# EAGLE design Garage_Controller (EAGLE 7.7.0)
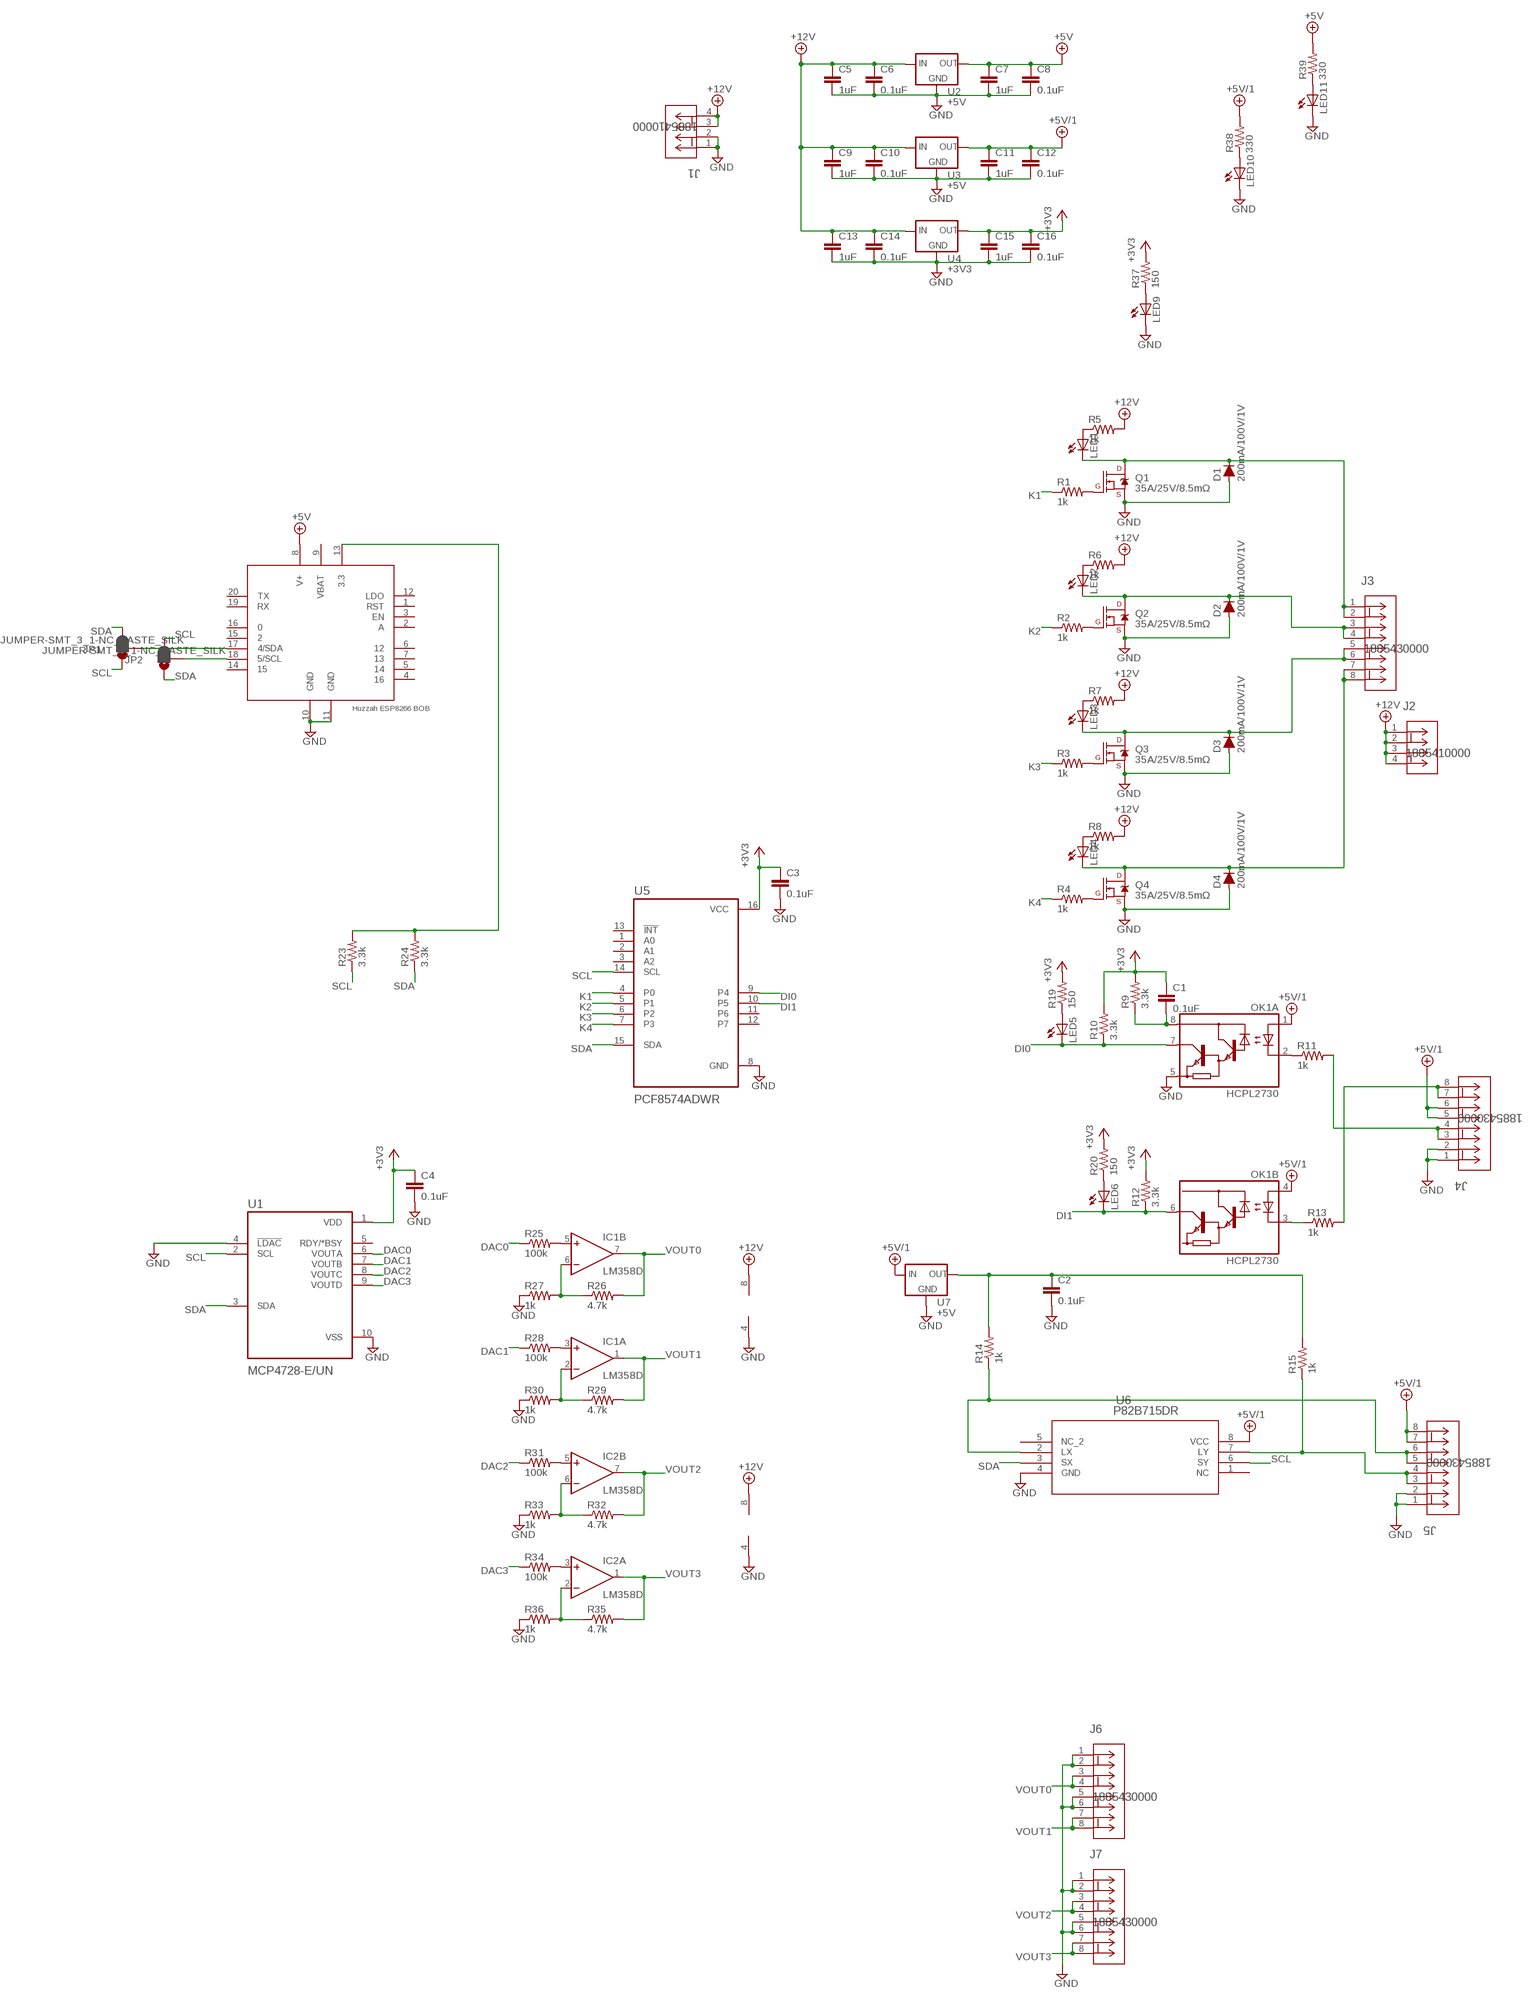
[diagram p0: schematic, sheet 1]

## Parts
C1  0.1uF  C-EUC0805  [C0805]
C2  0.1uF  C-EUC0805  [C0805]
C3  0.1uF  C-EUC0805  [C0805]
C4  0.1uF  C-EUC0805  [C0805]
C5  1uF  C-EUC0805  [C0805]
C6  0.1uF  C-EUC0805  [C0805]
C7  1uF  C-EUC0805  [C0805]
C8  0.1uF  C-EUC0805  [C0805]
C9  1uF  C-EUC0805  [C0805]
C10  0.1uF  C-EUC0805  [C0805]
C11  1uF  C-EUC0805  [C0805]
C12  0.1uF  C-EUC0805  [C0805]
C13  1uF  C-EUC0805  [C0805]
C14  0.1uF  C-EUC0805  [C0805]
C15  1uF  C-EUC0805  [C0805]
C16  0.1uF  C-EUC0805  [C0805]
D1  200mA/100V/1V  DIODE-1N4148  [DIODE-1N4148]
D2  200mA/100V/1V  DIODE-1N4148  [DIODE-1N4148]
D3  200mA/100V/1V  DIODE-1N4148  [DIODE-1N4148]
D4  200mA/100V/1V  DIODE-1N4148  [DIODE-1N4148]
IC1  LM358D  [SO08]
IC2  LM358D  [SO08]
J1  1885410000  [CONN_1885410000_WED]
J2  1885410000  [CONN_1885410000_WED]
J3  1885430000  [CONN_1885430000_WED]
J4  1885430000  [CONN_1885430000_WED]
J5  1885430000  [CONN_1885430000_WED]
J6  1885430000  [CONN_1885430000_WED]
J7  1885430000  [CONN_1885430000_WED]
JP1  JUMPER-SMT_3_1-NC_PASTE_SILK  [SMT-JUMPER_3_1-NC_PASTE_SILK]
JP2  JUMPER-SMT_3_1-NC_PASTE_SILK  [SMT-JUMPER_3_1-NC_PASTE_SILK]
LED1  LEDCHIP-LED0805  [CHIP-LED0805]
LED2  LEDCHIP-LED0805  [CHIP-LED0805]
LED3  LEDCHIP-LED0805  [CHIP-LED0805]
LED4  LEDCHIP-LED0805  [CHIP-LED0805]
LED5  LEDCHIP-LED0805  [CHIP-LED0805]
LED6  LEDCHIP-LED0805  [CHIP-LED0805]
LED9  LEDCHIP-LED0805  [CHIP-LED0805]
LED10  LEDCHIP-LED0805  [CHIP-LED0805]
LED11  LEDCHIP-LED0805  [CHIP-LED0805]
OK1  HCPL2730  [DIL08]
Q1  35A/25V/8.5mΩ  MOSFET-NCH-FDD8780  [TO-252/DPAK]
Q2  35A/25V/8.5mΩ  MOSFET-NCH-FDD8780  [TO-252/DPAK]
Q3  35A/25V/8.5mΩ  MOSFET-NCH-FDD8780  [TO-252/DPAK]
Q4  35A/25V/8.5mΩ  MOSFET-NCH-FDD8780  [TO-252/DPAK]
R1  1k  R-US_R0805  [R0805]
R2  1k  R-US_R0805  [R0805]
R3  1k  R-US_R0805  [R0805]
R4  1k  R-US_R0805  [R0805]
R5  1k  R-US_R0805  [R0805]
R6  1k  R-US_R0805  [R0805]
R7  1k  R-US_R0805  [R0805]
R8  1k  R-US_R0805  [R0805]
R9  3.3k  R-US_R0805  [R0805]
R10  3.3k  R-US_R0805  [R0805]
R11  1k  R-US_R0805  [R0805]
R12  3.3k  R-US_R0805  [R0805]
R13  1k  R-US_R0805  [R0805]
R14  1k  R-US_R0805  [R0805]
R15  1k  R-US_R0805  [R0805]
R19  150  R-US_R0805  [R0805]
R20  150  R-US_R0805  [R0805]
R23  3.3k  R-US_R0805  [R0805]
R24  3.3k  R-US_R0805  [R0805]
R25  100k  R-US_R0805  [R0805]
R26  4.7k  R-US_R0805  [R0805]
R27  1k  R-US_R0805  [R0805]
R28  100k  R-US_R0805  [R0805]
R29  4.7k  R-US_R0805  [R0805]
R30  1k  R-US_R0805  [R0805]
R31  100k  R-US_R0805  [R0805]
R32  4.7k  R-US_R0805  [R0805]
R33  1k  R-US_R0805  [R0805]
R34  100k  R-US_R0805  [R0805]
R35  4.7k  R-US_R0805  [R0805]
R36  1k  R-US_R0805  [R0805]
R37  150  R-US_R0805  [R0805]
R38  330  R-US_R0805  [R0805]
R39  330  R-US_R0805  [R0805]
U1  MCP4728-E/UN  [SOP50P490X110-10N]
U2  +5V  V_REG_78XX7812  [TO-252]
U3  +5V  V_REG_78XX7812  [TO-252]
U4  +3V3  V_REG_78XX7812  [TO-252]
U5  PCF8574ADWR  [SOIC127P1030X265-16N]
U6  P82B715DR  [SO-08]
U7  +5V  V_REG_78XX7812  [TO-252]
U$2  HUZZAH_ESP8266_BREAKOUT  [HUZZAH_ESP8266_BREAKOUT]

## Nets
+3V3: C1.1 C3.1 C4.1 C15.1 C16.1 R9.2 R10.2 R12.2 R19.2 R20.2 R37.2 U1.1(VDD) U4.2(OUT) U5.16(VCC)
+5V: C7.1 C8.1 R39.2 U2.2(OUT) U$2.8(V+)
+5V/1: C11.1 C12.1 J4.5 J4.6 J5.7 J5.8 OK1.1(A:A1) OK1.4(B:A2) R38.2 U3.2(OUT) U6.8(VCC) U7.1(IN)
+12V: C5.1 C6.1 C9.1 C10.1 C13.1 C14.1 IC1.8(P:V+) IC2.8(P:V+) J1.3 J1.4 J2.1 J2.2 J2.3 J2.4 R5.2 R6.2 R7.2 R8.2 U2.1(IN) U3.1(IN) U4.1(IN)
DAC0: R25.1 U1.6(VOUTA)
DAC1: R28.1 U1.7(VOUTB)
DAC2: R31.1 U1.8(VOUTC)
DAC3: R34.1 U1.9(VOUTD)
DI0: LED5.C OK1.7(A:VO1) R10.1 U5.9(P4)
DI1: LED6.C OK1.6(B:VO2) R12.1 U5.10(P5)
GND: C2.2 C3.2 C4.2 C5.2 C6.2 C7.2 C8.2 C9.2 C10.2 C11.2 C12.2 C13.2 C14.2 C15.2 C16.2 D1.A D2.A D3.A D4.A IC1.4(P:V-) IC2.4(P:V-) J1.1 J1.2 J4.1 J4.2 J5.1 J5.2 J6.1 J6.2 J6.5 J6.6 J7.1 J7.2 J7.5 J7.6 LED9.C LED10.C LED11.C OK1.5(A:GND) Q1.3(S) Q2.3(S) Q3.3(S) Q4.3(S) R27.1 R30.1 R33.1 R36.1 U1.4(!LDAC) U1.10(VSS) U2.3(GND) U3.3(GND) U4.3(GND) U5.8(GND) U6.4(GND) U7.3(GND) U$2.10(GND) U$2.11(GND)
K1: R1.1 U5.4(P0)
K2: R2.1 U5.5(P1)
K3: R3.1 U5.6(P2)
K4: R4.1 U5.7(P3)
N$1: D1.C J3.1 J3.2 LED1.C Q1.2(D)
N$2: Q1.1(G) R1.2
N$3: D2.C J3.3 J3.4 LED2.C Q2.2(D)
N$4: Q2.1(G) R2.2
N$5: D3.C J3.5 J3.6 LED3.C Q3.2(D)
N$6: Q3.1(G) R3.2
N$7: D4.C J3.7 J3.8 LED4.C Q4.2(D)
N$8: Q4.1(G) R4.2
N$9: LED1.A R5.1
N$10: IC1.5(B:+IN) R25.2
N$11: LED2.A R6.1
N$12: LED3.A R7.1
N$13: J4.7 J4.8 R13.2
N$14: LED4.A R8.1
N$15: C1.2 OK1.8(A:VCC) R9.1
N$16: IC1.6(B:-IN) R26.1 R27.2
N$17: OK1.2(A:C1) R11.1
N$18: IC1.3(A:+IN) R28.2
N$19: J4.3 J4.4 R11.2
N$20: J5.5 J5.6 R14.1 U6.2(LX)
N$21: C2.1 R14.2 R15.2 U7.2(OUT)
N$24: IC1.2(A:-IN) R29.1 R30.2
N$25: J5.3 J5.4 R15.1 U6.7(LY)
N$26: OK1.3(B:C2) R13.1
N$27: LED5.A R19.1
N$29: LED6.A R20.1
N$31: IC2.5(B:+IN) R31.2
N$32: IC2.6(B:-IN) R32.1 R33.2
N$33: IC2.2(A:-IN) R35.1 R36.2
N$34: IC2.3(A:+IN) R34.2
N$35: R23.2 R24.2 U$2.13(3.3)
N$36: LED9.A R37.1
N$37: LED10.A R38.1
N$38: LED11.A R39.1
N$39: JP2.2 U$2.18(5/SCL)
N$40: JP1.2 U$2.17(4/SDA)
SCL: JP1.1 JP2.3 R23.1 U1.2(SCL) U5.14(SCL) U6.6(SY)
SDA: JP1.3 JP2.1 R24.1 U1.3(SDA) U5.15(SDA) U6.3(SX)
VOUT0: IC1.7(B:OUT) J6.3 J6.4 R26.2
VOUT1: IC1.1(A:OUT) J6.7 J6.8 R29.2
VOUT2: IC2.7(B:OUT) J7.3 J7.4 R32.2
VOUT3: IC2.1(A:OUT) J7.7 J7.8 R35.2
Unconnected: U1.5(RDY/*BSY) U5.1(A0) U5.2(A1) U5.3(A2) U5.11(P6) U5.12(P7) U5.13(!INT) U6.1(NC) U6.5(NC_2) U$2.1(RST) U$2.2(A) U$2.3(EN) U$2.4 U$2.5 U$2.6 U$2.7 U$2.12(LDO) U$2.14 U$2.15 U$2.16 U$2.19(RX) U$2.20(TX)

## Power pins joined to a net without a drawn wire
VBAT: U$2.9(VBAT)

## Library data of the parts
C1-C16 = resistor:C-EU: CAPACITOR, European symbol
D1-D4 = SparkFun-DiscreteSemi:DIODE: Diode These are standard reverse protection diodes and small signal diodes. SparkFun Products: SparkFun SparkPunk Sound Kit <https://www.sparkfun.com/products/11177> SparkFun ESP8266 Thing <https://www.sparkfun.com/products/13231>; PROD_ID: DIO-08378
IC1 IC2 = linear:LM358: OP AMP also LM158; LM258; LM2904 Source: http://cache.national.com/ds/LM/LM158.pdf
J1 J2 = con-weidmueller-sl35:1885410000; COPYRIGHT: Copyright (C) 2026 Ultra Librarian. All rights reserved.; DESCRIPTION: Printed circuit board terminals, 3,81 mm, No. of poles: 2, 135°, Solder pin length: 1,5 mm, black, PUSH IN, Clamping range, max. [rated connection]: 1,5 mm°, Tube; MANUFACTURER_NAME: Weidmuller; MANUFACTURER_PART_NUMBER: 1885410000
J3-J7 = con-weidmueller-sl35:1885430000; COPYRIGHT: Copyright (C) 2026 Ultra Librarian. All rights reserved.; DESCRIPTION: Printed circuit board terminals, 3,81 mm, No. of poles: 4, 135°, Solder pin length: 1,5 mm, black, PUSH IN, Clamping range, max. [rated connection]: 1,5 mm°, Tube; MANUFACTURER_NAME: Weidmuller; MANUFACTURER_PART_NUMBER: 1885430000
JP1 JP2 = SparkFun-Jumpers:JUMPER-SMT_3_1-NC_PASTE: Normally closed solder jumper (1 of 2 connections) This jumper has an aperture in the stencil to allow solder paste to bridge one of the two connections. One connection is normally closed (NC), while the other is normally open (NO). Wick off the solder to open the connection. Reapply solder to reclose the connection. Apply solder to the other side instead to change the current path.
LED1-LED6 LED9-LED11 = led:LED: LED OSRAM: - CHIPLED LG R971, LG N971, LY N971, LG Q971, LY Q971, LO R971, LY R971 LH N974, LH R974 LS Q976, LO Q976, LY Q976 LO Q996 - Hyper CHIPLED LW Q18S LB Q993, LB Q99A, LB R99A - SideLED LS A670, LO A670, LY A670, LG A670, LP A670 LB A673, LV A673, LT A673, LW A673 LH A674 LY A675 LS A676, LA A676, LO A676, LY A676, LW A676 LS A679, LY A679, LG A679 - Hyper Micro SIDELED® LS Y876, LA Y876, LO Y876, LY Y876 LT Y87S - SmartLED LW L88C, LW L88S LB L89C, LB L89S, LG L890 LS L89K, LO L89K, LY L89K LS L896, LA L896, LO L896, LY L896 - TOPLED LS T670, LO T670, LY T670, LG T670, LP T670 LSG T670, LSP T670, LSY T670, LOP T670, LYG T670 LG T671, LOG T671, LSG T671 LB T673, LV T673, LT T673, LW T673 LH T674 LS T676, LA T676, LO T676, LY T676, LB T676, LH T676, LSB T676, LW T676 LB T67C, LV T67C, LT T67C, LS T67K, LO T67K, LY T67K, LW E67C LS E67B, LA E67B, LO E67B, LY E67B, LB E67C, LV E67C, LT E67C LW T67C LS T679, LY T679, LG T679 LS T770, LO T770, LY T770, LG T770, LP T770 LB T773, LV T773, LT T773, LW T773 LH T774 LS E675, LA E675, LY E675, LS T675 LS T776, LA T776, LO T776, LY T776, LB T776 LHGB T686 LT T68C, LB T68C - Hyper Mini TOPLED® LB M676 - Mini TOPLED Santana® LG M470 LS M47K, LO M47K, LY M47K Source: http://www.osram.convergy.de LUXEON: - LUMILED® LXK2-PW12-R00, LXK2-PW12-S00, LXK2-PW14-U00, LXK2-PW14-V00 LXK2-PM12-R00, LXK2-PM12-S00, LXK2-PM14-U00 LXK2-PE12-Q00, LXK2-PE12-R00, LXK2-PE12-S00, LXK2-PE14-T00, LXK2-PE14-U00 LXK2-PB12-K00, LXK2-PB12-L00, LXK2-PB12-M00, LXK2-PB14-N00, LXK2-PB14-P00, LXK2-PB14-Q00 LXK2-PR12-L00, LXK2-PR12-M00, LXK2-PR14-Q00, LXK2-PR14-R00 LXK2-PD12-Q00, LXK2-PD12-R00, LXK2-PD12-S00 LXK2-PH12-R00, LXK2-PH12-S00 LXK2-PL12-P00, LXK2-PL12-Q00, LXK2-PL12-R00 Source: www.luxeon.com KINGBRIGHT: KA-3528ASYC Source: www.kingbright.com
OK1 = optocoupler:HCPL2730: HEWLETT PACKARD OPTO COUPLER; MF: AGILENT TECHNOLOGIES; MPN: HCPL-2730-000E; OC_FARNELL: 9994840; OC_NEWARK: 88H7816
Q1-Q4 = SparkFun-DiscreteSemi:MOSFET-NCH: N-channel MOSFETs Voltage controlled devices that allow control of high current outputs. SparkFun Products: SparkFun OpenScale <https://www.sparkfun.com/products/13261> SparkFun Digital Sandbox <https://www.sparkfun.com/products/12651> SparkFun Monster Moto Shield <https://www.sparkfun.com/products/10182> SparkFun MOSFET Power Controller <https://www.sparkfun.com/products/11214>; PROD_ID: TRANS-09984
R1-R15 R19 R20 R23-R39 = resistor:R-US_: RESISTOR, American symbol
U1 = MCP4728-E_UN:MCP4728-E/UN
U2-U4 U7 = SparkFun-IC-Power:V_REG_78XX: Voltage Regulator Standard 78xx regulator. IGO (Input Ground Output). Spark Fun Electronics SKU : COM-00107; PROD_ID: VREG-12370; VALUE: +12v
U5 = PCF8574ADWR:PCF8574ADWR
U6 = texas:P82B715DR
U$2 = adafruit:HUZZAH_ESP8266_BREAKOUT

## Board
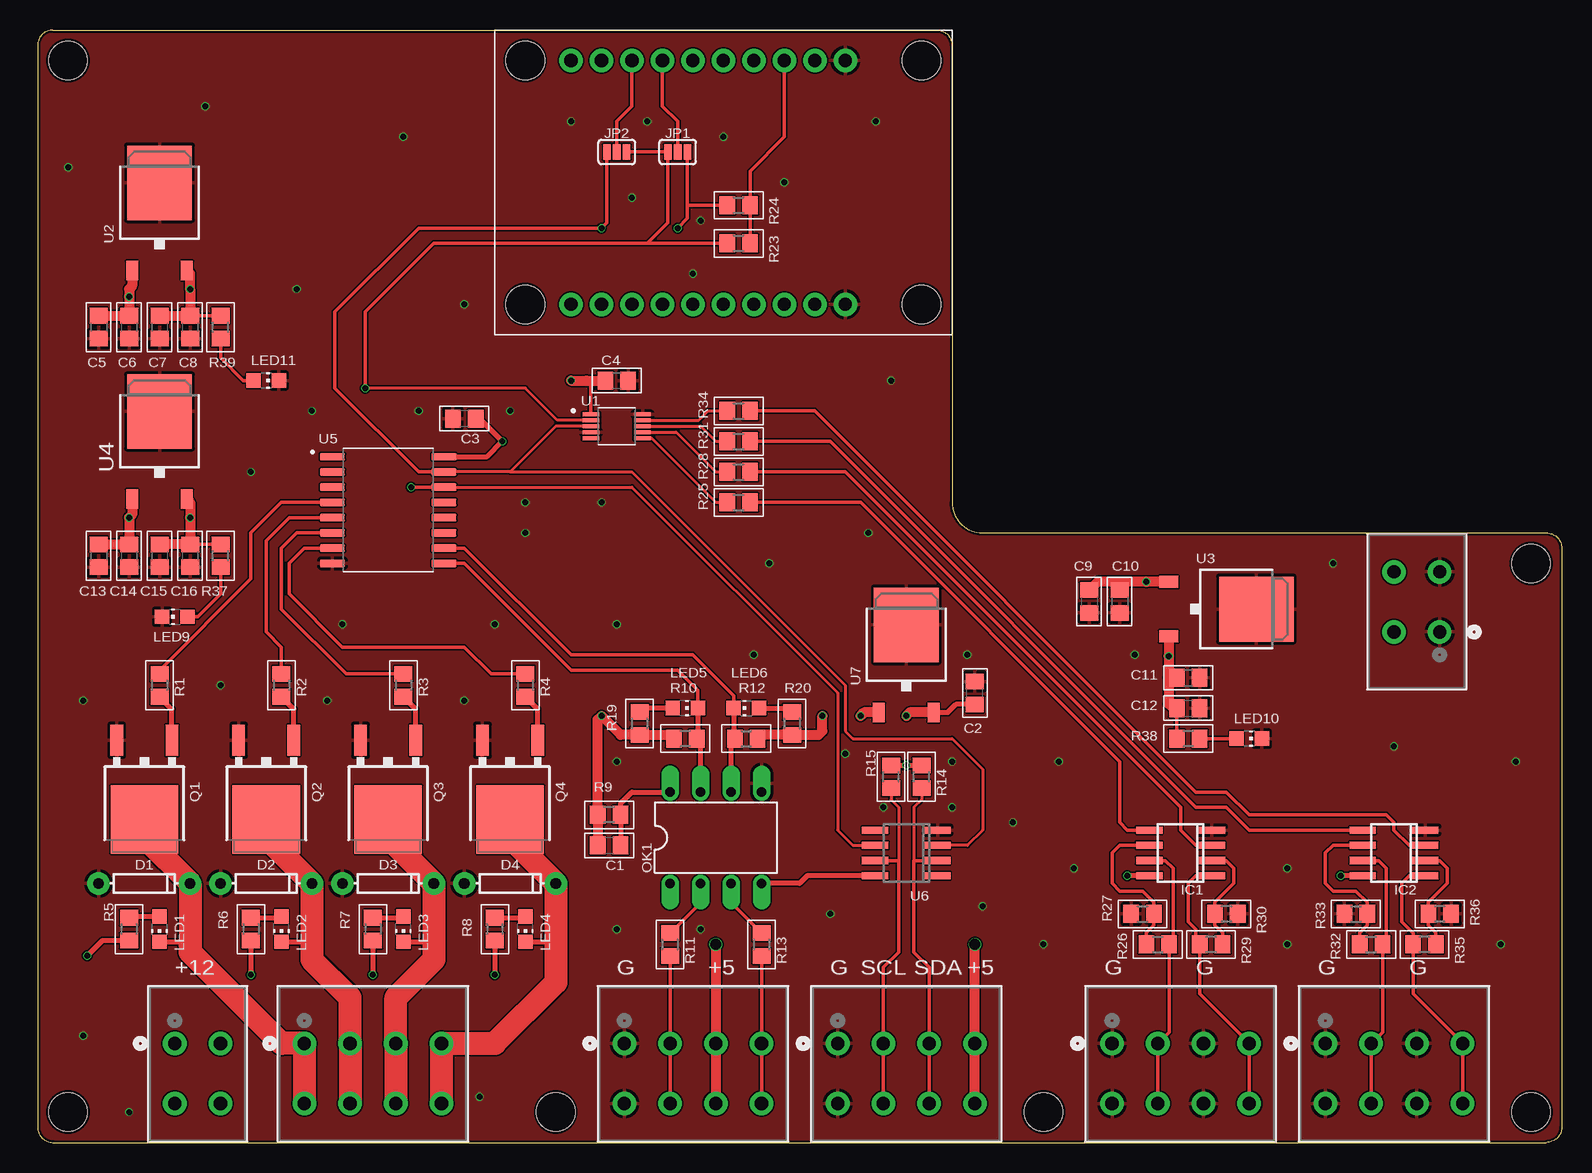
[diagram p1: board, top side]
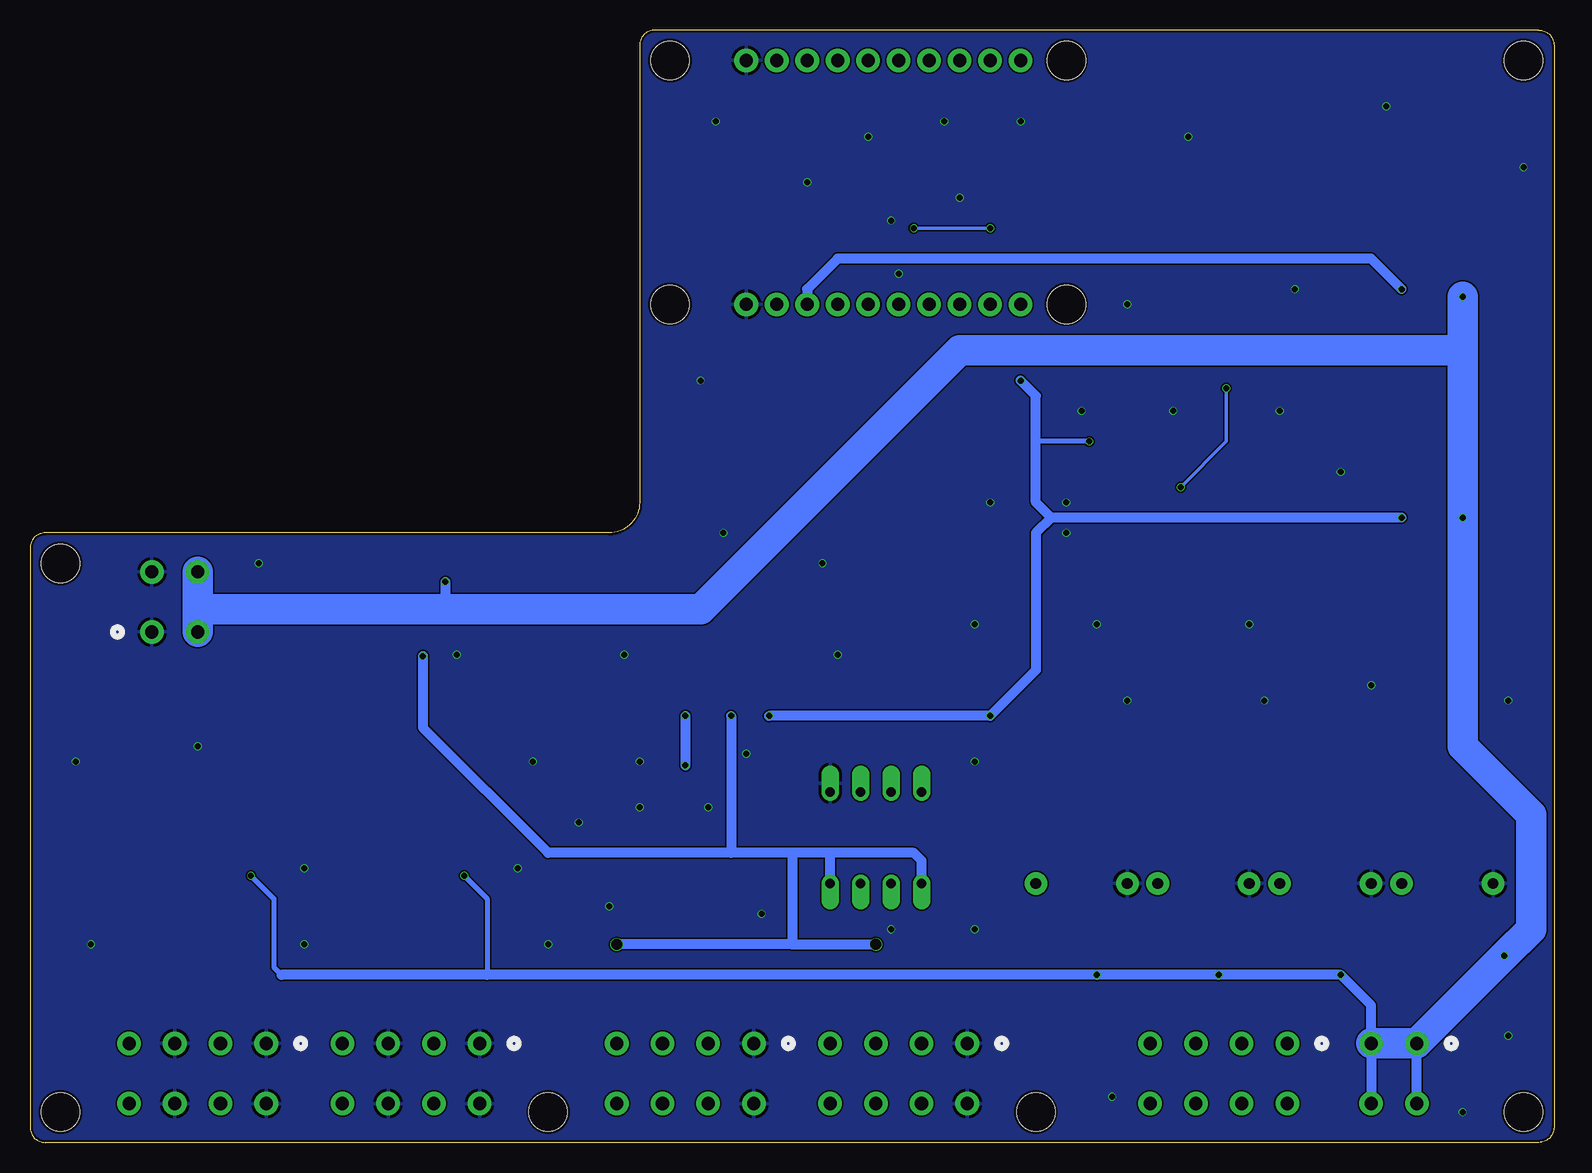
[diagram p2: board, bottom side, seen from below]

Size 127 x 92.71 mm. Coordinates in mm from the lower left corner, seen from the top.
Outline: 127,49.53 127,1.27 arc-90 125.73,0 1.27,0 arc-90 0,1.27 0,91.44 arc-90 1.27,92.71 74.93,92.71 arc-90 76.2,91.44 76.2,53.34 arc90 78.74,50.8 125.73,50.8 arc-90 127,49.53
Copper layers (1*16): Top 0.035mm / dielectric 1.6mm / Bottom 0.035mm
Design rules "jlcpcb-2layers": minimum track width 5mil, minimum drill 0.3mm, track to track 5mil, track to pad 5mil, pad to pad 5mil, via to via 5mil, smd to smd 5mil, copper to edge 0.2mm, drill to drill 6mil, minimum pad ring 10mil, minimum via ring 3mil, stop-mask expansion 4mil, vias tented up to drill 0mil, thermal gap 10mil
Holes 3.2 mm at 2.54,2.54 124.46,2.54 2.54,90.17 43.18,2.54 83.82,2.54 124.46,48.26

### Footprints (pad centres in the part's own frame; a part is rotated, then mirrored left to right if it is on the bottom)
C0805 = smd 1.3 x 1.5: 1 -0.95,0; 2 0.95,0
DIODE-1N4148 = drill 0.9 pad 1.88: A -3.81,0; C 3.81,0
SO08 = smd 0.6 x 2.2: 1 -1.905,-2.6; 2 -0.635,-2.6; 3 0.635,-2.6; 4 1.905,-2.6; 5 1.905,2.6; 6 0.635,2.6; 7 -0.635,2.6; 8 -1.905,2.6
CONN_1885410000_WED = drill 1.092 pad 1.6: 1 0,0; 2 0,-5.004; 3 3.81,0; 4 3.81,-5.004
CONN_1885430000_WED = drill 1.092 pad 1.6: 1 0,0; 2 0,-5.004; 3 3.81,0; 4 3.81,-5.004; 5 7.62,0; 6 7.62,-5.004; 7 11.43,0; 8 11.43,-5.004
SMT-JUMPER_3_1-NC_PASTE_SILK = smd 0.635 x 1.27: 1 -0.813,0; 2 0,0; 3 0.813,0
CHIP-LED0805 = smd 1.2 x 1.2: A 0,-1.05; C 0,1.05
DIL08 = drill 0.813 offset: 1 -3.81,-3.81; 2 -1.27,-3.81; 3 1.27,-3.81; 4 3.81,-3.81; 5 3.81,3.81; 6 1.27,3.81; 7 -1.27,3.81; 8 -3.81,3.81
TO-252/DPAK = smd 1.06 x 2.6: 1 -2.3,-4.31; 3 2.3,-4.31 | smd 5.632 x 5.7: 2 0,2.288
R0805 = smd 1.3 x 1.5: 1 -0.95,0; 2 0.95,0
SOP50P490X110-10N = smd 1.47 x 0.28: 1 -2.15,1; 2 -2.15,0.5; 3 -2.15,0; 4 -2.15,-0.5; 5 -2.15,-1; 6 2.15,-1; 7 2.15,-0.5; 8 2.15,0; 9 2.15,0.5; 10 2.15,1
TO-252 = smd 1 x 1.6: 1 -2.28,-4.8; 2 2.28,-4.8 | smd 5.4 x 6.2: 3 0,2.5
SOIC127P1030X265-16N = smd 2.06 x 0.6: 1 -4.64,4.445; 2 -4.64,3.175; 3 -4.64,1.905; 4 -4.64,0.635; 5 -4.64,-0.635; 6 -4.64,-1.905; 7 -4.64,-3.175; 8 -4.64,-4.445; 9 4.64,-4.445; 10 4.64,-3.175; 11 4.64,-1.905; 12 4.64,-0.635; 13 4.64,0.635; 14 4.64,1.905; 15 4.64,3.175; 16 4.64,4.445
SO-08 = smd 0.6 x 2.2: 1 -1.905,-2.6; 2 -0.635,-2.6; 3 0.635,-2.6; 4 1.905,-2.6; 5 1.905,2.6; 6 0.635,2.6; 7 -0.635,2.6; 8 -1.905,2.6
HUZZAH_ESP8266_BREAKOUT = drill 1.092 pad 1.6: 1 31.75,22.86; 2 29.21,22.86; 3 26.67,22.86; 4 24.13,22.86; 5 21.59,22.86; 6 19.05,22.86; 7 16.51,22.86; 8 13.97,22.86; 9 11.43,22.86; 10 8.89,22.86; 11 8.89,2.54; 12 11.43,2.54; 13 13.97,2.54; 14 16.51,2.54; 15 19.05,2.54; 16 21.59,2.54; 17 24.13,2.54; 18 26.67,2.54; 19 29.21,2.54; 20 31.75,2.54 | hole 3.2: 2.54,22.86; 35.56,22.86; 35.56,2.54; 2.54,2.54

### Placement (x,y rotation side)
C1  47.62,24.77 0 top
C2  78.11,37.47 90 top
C3  35.56,60.33 180 top
C4  48.26,63.5 0 top
C5  5.08,67.94 270 top
C6  7.62,67.94 270 top
C7  10.16,67.94 270 top
C8  12.7,67.94 270 top
C9  87.63,45.09 270 top
C10  90.17,45.09 270 top
C11  95.89,38.73 0 top
C12  95.89,36.2 0 top
C13  5.08,48.9 270 top
C14  7.62,48.9 270 top
C15  10.16,48.9 270 top
C16  12.7,48.9 270 top
D1  8.89,21.59 0 top
D2  19.05,21.59 0 top
D3  29.21,21.59 0 top
D4  39.37,21.59 0 top
IC1  95.25,24.13 90 top
IC2  113.03,24.13 90 top
J1  116.84,42.55 180 top
J2  11.43,8.26 0 top
J3  22.23,8.26 0 top
J4  48.9,8.26 0 top
J5  66.67,8.26 0 top
J6  89.53,8.26 0 top
J7  107.31,8.26 0 top
JP1  53.34,82.55 0 top
JP2  48.26,82.55 0 top
LED1  10.16,17.78 180 top
LED2  20.32,17.78 180 top
LED3  30.48,17.78 180 top
LED4  40.64,17.78 180 top
LED5  53.98,36.2 270 top
LED6  59.05,36.2 90 top
LED9  11.43,43.81 90 top
LED10  100.97,33.66 270 top
LED11  19.05,63.5 270 top
OK1  56.52,25.4 0 top
Q1  8.89,29.21 180 top
Q2  19.05,29.21 180 top
Q3  29.21,29.21 180 top
Q4  39.37,29.21 180 top
R1  10.16,38.1 270 top
R2  20.32,38.1 270 top
R3  30.48,38.1 270 top
R4  40.64,38.1 270 top
R5  7.62,17.78 270 top
R6  17.78,17.78 270 top
R7  27.94,17.78 270 top
R8  38.1,17.78 270 top
R9  47.62,27.3 180 top
R10  53.98,33.66 180 top
R11  52.7,16.51 270 top
R12  59.05,33.66 0 top
R13  60.33,16.51 270 top
R14  73.66,30.48 90 top
R15  71.12,30.48 90 top
R19  50.16,34.92 270 top
R20  62.87,34.92 270 top
R23  58.42,74.93 0 top
R24  58.42,78.11 0 top
R25  58.42,53.34 0 top
R26  93.34,16.51 0 top
R27  92.08,19.05 0 top
R28  58.42,55.88 0 top
R29  97.79,16.51 180 top
R30  99.06,19.05 180 top
R31  58.42,58.42 0 top
R32  111.12,16.51 0 top
R33  109.86,19.05 0 top
R34  58.42,60.96 0 top
R35  115.57,16.51 180 top
R36  116.84,19.05 180 top
R37  15.24,48.9 90 top
R38  95.89,33.66 180 top
R39  15.24,67.94 90 top
U1  48.26,59.69 0 top
U2  10.16,77.47 0 top
U3  99.06,44.45 270 top
U4  10.16,58.42 0 top
U5  29.21,52.7 0 top
U6  72.39,24.13 90 top
U7  72.39,40.64 0 top
U$2  76.2,92.71 180 top

### Tracks (layer width: path | path; a pad name or v marks a point on that pad's centre or on a via)
+3V3  (via drill 0.5)
  Top 0.305: U1.1 46.11,63.11 45.72,63.5 | R37.2 C16.1
  Top 0.406: U5.16 37.47,57.15 v38.73,58.42 36.83,60.33 C3.1
  Top 0.813: U4.2 12.44,53.6 12.7,53.34 v12.7,52.07 C16.1 C15.1 | v44.45,63.5 45.72,63.5 C4.1 | C1.1 R9.2 46.67,35.24 v46.99,35.56 48.58,33.98 R19.2 52.7,33.98 R10.2 | R12.2 60.33,33.98 R20.2 65.09,33.98 65.41,34.29 v65.41,35.56
  Bottom 0.406: v38.73,58.42 43.18,58.42
  Bottom 0.813: v12.7,52.07 41.91,52.07 | 41.91,52.07 43.18,53.34 43.18,58.42 43.18,62.23 v44.45,63.5 | 41.91,52.07 43.18,50.8 43.18,39.37 v46.99,35.56 v65.41,35.56
+5V  (via drill 0.5)
  Top 0.305: R39.2 C8.1
  Top 0.813: U2.2 12.7,72.41 v12.7,71.12 C8.1 C7.1
  Bottom 0.813: v12.7,71.12 15.24,73.66 59.69,73.66 62.23,71.12 U$2.8
+5V/1  (via drill 0.5, 0.9)
  Top 0.305: R38.2 C12.1
  Top 0.406: U6.8 64.14,22.23 63.5,21.59 OK1.4
  Top 0.813: U3.2 v94.26,40.54 94.26,38.73 | 94.26,38.73 94.26,36.55 94.61,36.2 C12.1 | C11.1 94.26,38.73 | v56.52,16.51 J4.5 J4.6 | J5.8 J5.7 v78.11,16.51 | U7.1 68.86,35.84 v68.58,35.56
  Bottom 0.813: OK1.1 52.7,23.5 53.34,24.13 60.33,24.13 | 60.33,24.13 63.5,24.13 | 63.5,24.13 68.58,24.13 | 68.58,24.13 83.82,24.13 94.26,34.57 v94.26,40.54 | OK1.4 60.33,24.13 | 63.5,24.13 63.5,16.51 | 63.5,16.51 v56.52,16.51 | 63.5,16.51 v78.11,16.51 | v68.58,35.56 68.58,24.13
+12V  (via drill 0.5)
  Top 0.406: R5.2 5.4,16.83 v4.13,15.56 | 7.62,53.88 U4.1 | R6.2 v17.78,13.97 | R7.2 v27.94,13.97 | R8.2 v38.1,13.97 | IC1.8 v90.81,22.23 | IC2.8 v108.58,22.23
  Top 0.813: U2.1 7.88,71.38 7.62,71.12 v7.62,70.48 C6.1 C5.1 | U4.1 7.88,52.33 v7.62,52.07 C14.1 C13.1 | U3.1 v92.39,46.73 90.17,46.73 | 90.17,46.73 88.33,46.73 C9.1 | C10.1 90.17,46.73
  Bottom 0.406: v90.81,22.23 88.9,20.32 88.9,13.97 | v108.58,22.23 106.68,20.32 106.68,14.61 106.05,13.97
  Bottom 0.813: 106.05,13.97 88.9,13.97 v38.1,13.97 v27.94,13.97 v17.78,13.97 15.24,11.43 J2.3 J2.4 | J2.2 J2.1 | v92.39,46.73 92.39,44.77 92.71,44.45
  Bottom 2.54: v7.62,70.48 7.62,66.04 | 7.62,66.04 v7.62,52.07 7.62,33.02 1.91,27.3 1.91,17.78 v4.13,15.56 J2.1 J2.3 | 7.62,66.04 49.53,66.04 71.12,44.45 92.71,44.45 113.03,44.45 | J1.4 113.03,44.45 | 113.03,44.45 J1.3
DAC0
  Top 0.254: U1.6 51.16,58.69 56.52,53.34 R25.1
DAC1
  Top 0.254: U1.7 53.2,59.19 56.52,55.88 R28.1
DAC2
  Top 0.254: U1.8 55.24,59.69 56.52,58.42 R31.1
DAC3
  Top 0.254: U1.9 55.11,60.19 55.88,60.96 R34.1
DI0
  Top 0.305: LED5.C 55.02,37.69 53.34,39.37 44.45,39.37 35.56,48.26 U5.9
  Top 0.406: OK1.7 55.24,33.34 R10.1 55.02,33.76 LED5.C
DI1
  Top 0.305: LED6.C 58.01,37.24 54.61,40.64 44.45,40.64 35.56,49.53 U5.10
  Top 0.406: OK1.6 57.78,33.34 R12.1 58.01,33.76 LED6.C
GND  (via drill 0.5)
  other vias: 46.99,53.34 31.75,60.96 22.86,60.96 17.78,55.88 13.97,86.36 2.54,81.28 30.48,83.82 44.45,85.09 62.23,80.01 54.61,72.39 39.37,60.96 35.56,69.85 21.59,71.12 35.56,36.83 38.1,43.18 25.4,43.18 15.24,38.1 24.13,36.83 3.81,36.83 48.26,17.78 48.26,31.75 66.04,19.05 81.28,26.67 85.09,31.75 77.47,40.64 60.96,48.26 3.81,8.89 7.62,2.54 36.83,3.81 86.36,22.86 83.82,16.51 104.14,22.86 104.14,16.51 121.92,16.51 123.19,31.75 113.03,33.02 91.44,40.64 71.12,63.5 40.64,53.34 40.64,50.8 107.95,48.26 55.24,17.78 78.74,19.68 50.8,85.09 49.53,78.74 57.15,83.82 69.85,85.09 55.24,76.83 76.2,27.94 67.31,32.38 59.69,40.64 48.26,43.18 76.2,31.75 70.48,27.94 69.22,50.8
  pour Bottom: -2.54,95.25 130.81,95.25 130.81,-5.08 -2.54,-5.08 -2.54,93.98
  pour Top: -1.27,93.98 129.54,93.98 129.54,-2.54 -1.27,-2.54
K1
  Top 0.305: U5.4 20.32,53.34 17.78,50.8 17.78,46.99 10.16,39.37 R1.1
K2
  Top 0.305: U5.5 20.95,52.07 19.05,50.16 19.05,42.55 20.32,41.27 R2.1
K3
  Top 0.305: U5.6 21.59,50.8 20.32,49.53 20.32,44.45 25.72,39.05 R3.1
K4
  Top 0.305: U5.7 22.23,49.53 20.95,48.26 20.95,45.72 25.4,41.27 35.56,41.27 37.78,39.05 R4.1
N$1
  Top 0.406: LED1.C 12.48,16.73 12.7,16.51
  Top 1.93: Q1.2 8.89,25.4 D1.C 12.7,16.51 12.7,15.88 20.32,8.26 J3.1 J3.2
N$2
  Top 0.406: Q1.1 11.19,36.12 R1.2
N$3
  Top 0.406: LED2.C 22.64,16.73 22.86,15.24
  Top 1.93: Q2.2 19.05,25.4 D2.C 22.86,15.24 26.04,12.06 J3.3 J3.4
N$4
  Top 0.406: Q2.1 21.35,36.12 R2.2
N$5
  Top 0.406: LED3.C 32.8,16.73 33.02,15.24
  Top 1.93: Q3.2 29.21,25.4 D3.C 33.02,15.24 29.84,12.06 J3.5 J3.6
N$6
  Top 0.406: Q3.1 31.51,36.12 R3.2
N$7
  Top 0.406: LED4.C 42.96,16.73 43.18,16.51
  Top 1.93: Q4.2 39.37,25.4 D4.C 43.18,16.51 43.18,13.34 38.1,8.26 J3.7 J3.8
N$8
  Top 0.406: Q4.1 41.67,36.12 R4.2
N$9
  Top 0.406: LED1.A 7.72,18.83 R5.1
N$10
  Top 0.305: R25.2 68.58,53.34 90.17,31.75 90.17,26.67 90.81,26.04 IC1.5
N$11
  Top 0.406: R6.1 20.42,18.73 LED2.A
N$12
  Top 0.406: R7.1 30.58,18.73 LED3.A
N$13
  Top 0.305: J4.8 J4.7 R13.2
N$14
  Top 0.406: R8.1 40.74,18.73 LED4.A
N$15
  Top 0.406: OK1.8 49.53,29.21 48.58,28.25 R9.1 C1.2
N$16
  Top 0.305: IC1.6 90.17,24.77 89.53,24.13 89.53,21.59 90.17,20.95 92.08,20.95 93.03,20 R27.2 93.03,18.09 92.39,17.46 R26.1
N$17
  Top 0.305: OK1.2 55.24,20 R11.1
N$18
  Top 0.305: R28.2 67.31,55.88 95.25,27.94 95.25,26.04 96.52,24.77 IC1.3
N$19
  Top 0.305: R11.2 J4.3 J4.4
N$20
  Top 0.254: R14.1 73.66,28.57 73.03,27.94 73.03,23.5
  Top 0.305: U6.2 73.03,23.5 73.03,15.88 74.3,14.61 J5.5 J5.6
N$21  (via drill 0.5)
  Top 0.406: R15.2 v72.39,31.43 R14.2 | U7.2 75.84,35.84 76.52,36.52 C2.1
  Top 0.813: U7.2 72.67,35.84 v72.39,35.56
  Bottom 0.813: v72.39,35.56 v72.39,31.43
N$24
  Top 0.305: IC1.2 99.06,23.5 99.69,22.86 99.69,21.59 98.11,20 R30.2 98.11,18.09 98.74,17.46 R29.1
N$25
  Top 0.254: R15.1 71.12,28.57 71.75,27.94 71.75,23.5
  Top 0.305: J5.4 J5.3 70.48,14.61 71.75,15.88 71.75,23.5 U6.7
N$26
  Top 0.305: OK1.3 57.78,20 R13.1
N$27
  Top 0.406: LED5.A 50.48,36.2 R19.1
N$29
  Top 0.406: LED6.A 62.55,36.2 R20.1
N$31
  Top 0.305: IC2.5 100.97,26.04 99.06,27.94 96.52,27.94 66.04,58.42 R31.2
N$32
  Top 0.305: R32.1 110.17,17.46 110.81,18.09 R33.2 110.81,20 109.86,20.95 107.95,20.95 107.31,21.59 107.31,24.13 107.95,24.77 IC2.6
N$33
  Top 0.305: R35.1 116.52,17.46 115.89,18.09 R36.2 115.89,20 117.47,21.59 117.47,22.86 116.84,23.5 IC2.2
N$34
  Top 0.305: IC2.3 114.3,24.77 113.03,26.04 113.03,26.67 112.39,27.3 100.97,27.3 99.06,29.21 96.52,29.21 64.77,60.96 R34.2
N$35
  Top 0.305: R23.2 R24.2 59.37,80.96 62.23,83.82 U$2.13
N$36
  Top 0.305: LED9.A 13.34,43.81 15.24,45.72 R37.1
N$37
  Top 0.305: LED10.A R38.1
N$38
  Top 0.305: LED11.A 17.14,63.5 15.24,65.41 R39.1
N$39
  Top 0.305: U$2.18 49.53,86.36 48.26,85.09 JP2.2
N$40
  Top 0.305: U$2.17 52.07,86.36 53.34,85.09 JP1.2
SCL  (via drill 0.5)
  Top 0.254: U1.2 43.31,60.19 40.64,62.87 v27.3,62.87 | U5.14 49.53,54.61 66.67,37.47 66.67,26.04 67.94,24.77 U6.6
  Top 0.305: v31.11,54.61 U5.14 | v27.3,62.87 27.3,69.22 33.02,74.93 50.8,74.93 | 50.8,74.93 52.53,76.66 JP1.1 JP2.3 | 50.8,74.93 R23.1
  Bottom 0.305: v27.3,62.87 27.3,58.42 v31.11,54.61
SDA  (via drill 0.5)
  Top 0.254: U1.3 43.18,59.69 39.37,55.88 | 39.37,55.88 U5.15 | 39.37,55.88 49.53,55.88 67.31,38.1 67.31,34.29 67.94,33.66 76.2,33.66 78.74,31.11 78.74,26.04 77.47,24.77 U6.3
  Top 0.305: U5.15 31.75,55.88 24.77,62.87 24.77,69.22 31.75,76.2 v46.99,76.2 47.45,76.66 JP2.1 | JP1.3 54.15,78.11 | 54.15,78.11 54.15,77.01 v53.34,76.2 | R24.1 54.15,78.11
  Bottom 0.305: v46.99,76.2 v53.34,76.2
VOUT0
  Top 0.305: J6.4 J6.3 94.3,9.21 R26.2 94.61,16.83 94.61,22.86 93.98,23.5 IC1.7
VOUT1
  Top 0.305: IC1.1 96.52,22.23 95.89,21.59 95.89,18.41 96.52,17.78 96.52,16.83 R29.2 96.84,12.38 J6.7 J6.8
VOUT2
  Top 0.305: IC2.7 111.76,23.5 112.39,22.86 112.39,16.83 R32.2 112.08,9.21 J7.3 J7.4
VOUT3
  Top 0.305: IC2.1 114.3,22.23 113.67,21.59 113.67,18.41 114.62,17.46 R35.2 114.62,12.38 J7.7 J7.8

### Text on the board
tPlace: +12 | G | +5 | G | SCL | SDA | +5 | G | G | G | G